# Altium project EMMC_FLASH.PrjPCB
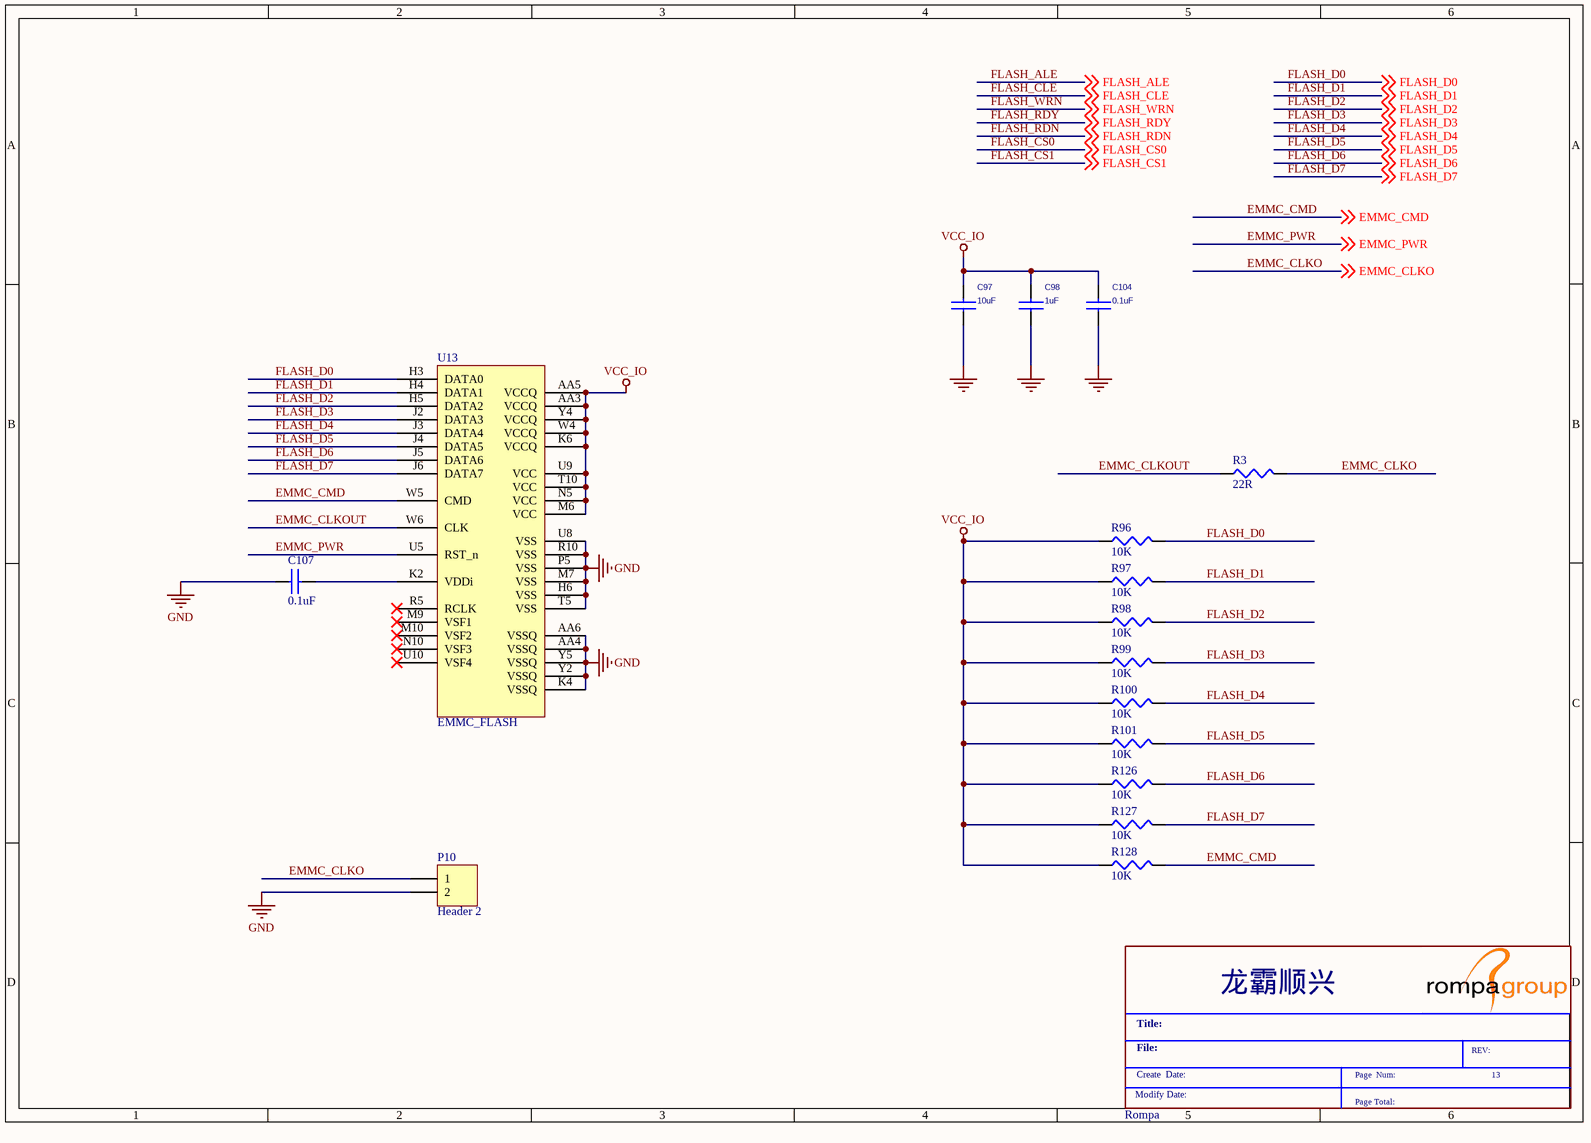
[diagram p0: Option_EMCC_Flash.SchDoc]
1 sheet, 17 parts. Net scope: global (net labels, ports and power ports of the same name join across sheets).

## Sheet Option_EMCC_Flash.SchDoc
size 297 x 209 mm

### Parts
*  Rompa  Schematic Page Number: 13  (graphical)
C97  10uF
C98  1uF
C104  0.1uF  [C0402]
C107  0.1uF  [C0402]
P10  Header 2  [HDR1X2]
R3  22R  [R0402]
R96  10K  [R0402]
R97  10K  [R0402]
R98  10K  [R0402]
R99  10K  [R0402]
R100  10K  [R0402]
R101  10K  [R0402]
R126  10K  [R0402]
R127  10K  [R0402]
R128  10K  [R0402]
U13  EMMC_FLASH

### Nets
GND: C97.1 C98.1 C104.1 C107.1 P10.2 U13.AA4(VSSQ) U13.AA6(VSSQ) U13.H6(VSS) U13.K4(VSSQ) U13.M7(VSS) U13.P5(VSS) U13.R10(VSS) U13.T5(VSS) U13.U8(VSS) U13.Y2(VSSQ) U13.Y5(VSSQ)
VCC_IO: C97.2 C98.2 C104.2 R96.1 R97.1 R98.1 R99.1 R100.1 R101.1 R126.1 R127.1 R128.1 U13.AA3(VCCQ) U13.AA5(VCCQ) U13.K6(VCCQ) U13.M6(VCC) U13.N5(VCC) U13.T10(VCC) U13.U9(VCC) U13.W4(VCCQ) U13.Y4(VCCQ)
EMMC_CLKO: P10.1 R3.2 ; off-sheet EMMC_CLKO
EMMC_CLKOUT: R3.1 U13.W6(CLK)
EMMC_CMD: R128.2 U13.W5(CMD) ; off-sheet EMMC_CMD
EMMC_PWR: U13.U5(RST_n) ; off-sheet EMMC_PWR
FLASH_D0: R96.2 U13.H3(DATA0) ; off-sheet FLASH_D0
FLASH_D1: R97.2 U13.H4(DATA1) ; off-sheet FLASH_D1
FLASH_D2: R98.2 U13.H5(DATA2) ; off-sheet FLASH_D2
FLASH_D3: R99.2 U13.J2(DATA3) ; off-sheet FLASH_D3
FLASH_D4: R100.2 U13.J3(DATA4) ; off-sheet FLASH_D4
FLASH_D5: R101.2 U13.J4(DATA5) ; off-sheet FLASH_D5
FLASH_D6: R126.2 U13.J5(DATA6) ; off-sheet FLASH_D6
FLASH_D7: R127.2 U13.J6(DATA7) ; off-sheet FLASH_D7
NetC107_2: C107.2 U13.K2(VDDi)

Not connected (* = marked no-connect by the designer): U13 M9(VSF1)* M10(VSF2)* N10(VSF3)* R5(RCLK)* U10(VSF4)*

### Notes on the sheet
- (in symbol Rompa) 龙霸顺兴; Title:; File:; REV:; Create  Date:; Page  Num:; Modify Date:; Page Total:

### Library data of the parts
C97 = CAP NP: X5R 10%  6.3V
C98 = CAP NP: +10/-10% X5R  6.3V
C104 = CAP NP: RoHS CHIP CAP 0.1uF +10/-10% X7R
C107 = CAP NP
P10 = Header 2: Header, 2-Pin; LatestRevisionDate: 17-Jul-2002; LatestRevisionNote: Re-released for DXP Platform.; Publisher: Altium Limited
R3 R96-R101 R126-R128 = RESISTOR
U13 = EMMC_FLASH: EMMC Flash